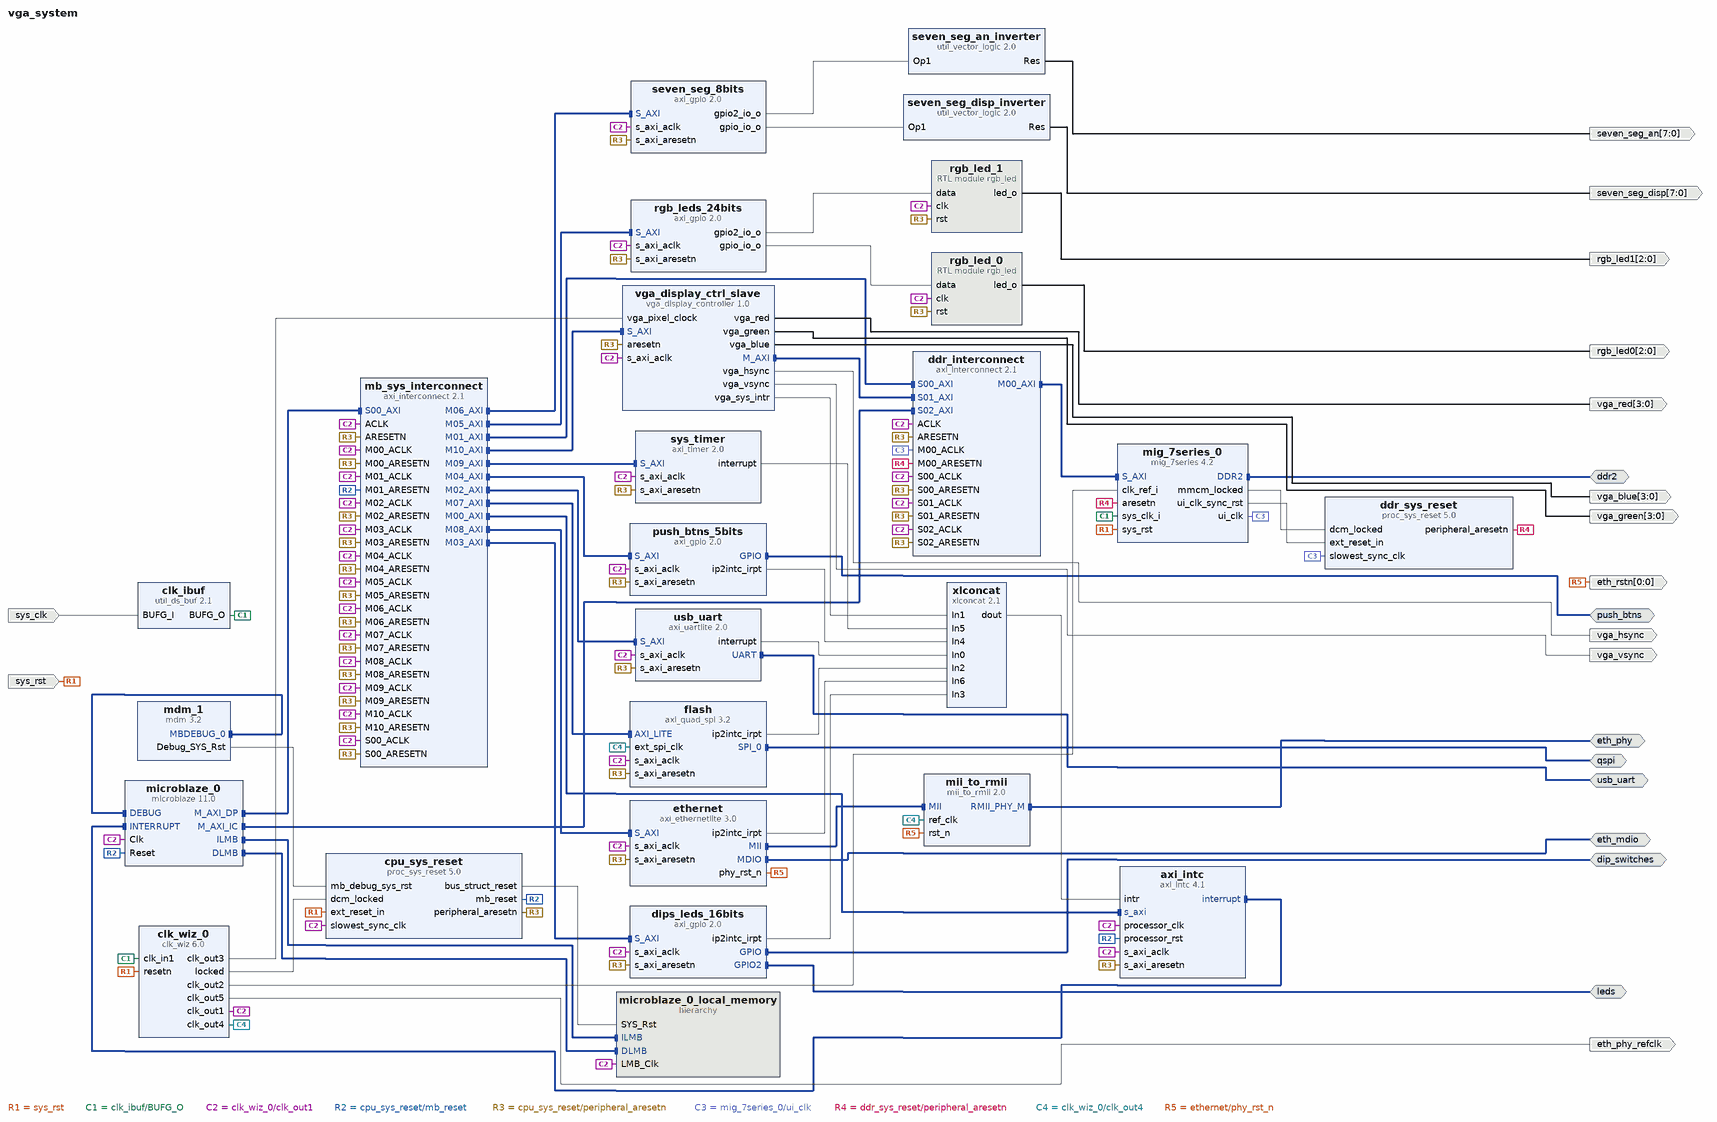
[diagram p0: block diagram of the top level]
# Vivado block design vga_system, xc7a100tcsg324-1, Vivado 2018.3.1
create_bd_design vga_system

create_bd_intf_port -mode Master -vlnv xilinx.com:interface:ddrx_rtl:1.0 ddr2
create_bd_intf_port -mode Master -vlnv xilinx.com:interface:uart_rtl:1.0 usb_uart
create_bd_intf_port -mode Master -vlnv xilinx.com:interface:gpio_rtl:1.0 leds
create_bd_intf_port -mode Master -vlnv xilinx.com:interface:gpio_rtl:1.0 push_btns
create_bd_intf_port -mode Master -vlnv xilinx.com:interface:gpio_rtl:1.0 dip_switches
create_bd_intf_port -mode Master -vlnv xilinx.com:interface:spi_rtl:1.0 qspi
create_bd_intf_port -mode Master -vlnv xilinx.com:interface:rmii_rtl:1.0 eth_phy
create_bd_intf_port -mode Master -vlnv xilinx.com:interface:mdio_rtl:1.0 eth_mdio
create_bd_port -dir I -type clk sys_clk
set_property -dict {CONFIG.ASSOCIATED_RESET sys_rst CONFIG.FREQ_HZ 100000000} [get_bd_ports sys_clk]
create_bd_port -dir I -type rst sys_rst
create_bd_port -dir O -from 7 -to 0 seven_seg_disp
create_bd_port -dir O -from 7 -to 0 seven_seg_an
create_bd_port -dir O -type clk eth_phy_refclk
set_property -dict {CONFIG.ASSOCIATED_RESET eth_rstn CONFIG.FREQ_HZ 50000000} [get_bd_ports eth_phy_refclk]
create_bd_port -dir O -from 0 -to 0 -type rst eth_rstn
create_bd_port -dir O -from 3 -to 0 vga_red
create_bd_port -dir O -from 3 -to 0 vga_green
create_bd_port -dir O -from 3 -to 0 vga_blue
create_bd_port -dir O vga_hsync
create_bd_port -dir O vga_vsync
create_bd_port -dir O -from 2 -to 0 rgb_led0
create_bd_port -dir O -from 2 -to 0 rgb_led1

create_bd_cell -type ip -vlnv xilinx.com:ip:mig_7series:4.2 mig_7series_0
set_property -dict [list \
  CONFIG.BOARD_MIG_PARAM Custom \
  CONFIG.RESET_BOARD_INTERFACE Custom \
  CONFIG.XML_INPUT_FILE mig_a.prj \
] [get_bd_cells mig_7series_0]
create_bd_cell -type ip -vlnv xilinx.com:ip:util_ds_buf:2.1 clk_ibuf
set_property -dict {CONFIG.C_BUF_TYPE BUFG} [get_bd_cells clk_ibuf]
create_bd_cell -type ip -vlnv xilinx.com:ip:clk_wiz:6.0 clk_wiz_0
set_property -dict [list \
  CONFIG.CLKOUT1_JITTER 144.481 \
  CONFIG.CLKOUT1_REQUESTED_OUT_FREQ 62.500 \
  CONFIG.CLKOUT2_JITTER 114.829 \
  CONFIG.CLKOUT2_PHASE_ERROR 98.575 \
  CONFIG.CLKOUT2_REQUESTED_OUT_FREQ 200.000 \
  CONFIG.CLKOUT2_USED true \
  CONFIG.CLKOUT3_JITTER 151.636 \
  CONFIG.CLKOUT3_PHASE_ERROR 98.575 \
  CONFIG.CLKOUT3_REQUESTED_OUT_FREQ 50.000 \
  CONFIG.CLKOUT3_USED true \
  CONFIG.CLKOUT4_JITTER 151.636 \
  CONFIG.CLKOUT4_PHASE_ERROR 98.575 \
  CONFIG.CLKOUT4_REQUESTED_OUT_FREQ 50.000 \
  CONFIG.CLKOUT4_USED true \
  CONFIG.CLKOUT5_JITTER 151.636 \
  CONFIG.CLKOUT5_PHASE_ERROR 98.575 \
  CONFIG.CLKOUT5_REQUESTED_OUT_FREQ 50.000 \
  CONFIG.CLKOUT5_REQUESTED_PHASE 45.000 \
  CONFIG.CLKOUT5_USED true \
  CONFIG.MMCM_CLKOUT0_DIVIDE_F 16.000 \
  CONFIG.MMCM_CLKOUT1_DIVIDE 5 \
  CONFIG.MMCM_CLKOUT2_DIVIDE 20 \
  CONFIG.MMCM_CLKOUT3_DIVIDE 20 \
  CONFIG.MMCM_CLKOUT4_DIVIDE 20 \
  CONFIG.MMCM_CLKOUT4_PHASE 45.000 \
  CONFIG.MMCM_DIVCLK_DIVIDE 1 \
  CONFIG.NUM_OUT_CLKS 5 \
  CONFIG.PRIM_SOURCE No_buffer \
  CONFIG.RESET_PORT resetn \
  CONFIG.RESET_TYPE ACTIVE_LOW \
] [get_bd_cells clk_wiz_0]
create_bd_cell -type ip -vlnv xilinx.com:ip:microblaze:11.0 microblaze_0
set_property -dict [list \
  CONFIG.C_ADDR_TAG_BITS 16 \
  CONFIG.C_CACHE_BYTE_SIZE 2048 \
  CONFIG.C_DCACHE_ADDR_TAG 0 \
  CONFIG.C_DEBUG_ENABLED 1 \
  CONFIG.C_D_AXI 1 \
  CONFIG.C_D_LMB 1 \
  CONFIG.C_ICACHE_LINE_LEN 8 \
  CONFIG.C_I_LMB 1 \
  CONFIG.C_USE_BARREL 1 \
  CONFIG.C_USE_DCACHE 0 \
  CONFIG.C_USE_ICACHE 1 \
  CONFIG.C_USE_REORDER_INSTR 0 \
] [get_bd_cells microblaze_0]
create_bd_cell -type hier microblaze_0_local_memory
create_bd_cell -type ip -vlnv xilinx.com:ip:axi_interconnect:2.1 mb_sys_interconnect
set_property -dict {CONFIG.NUM_MI 11} [get_bd_cells mb_sys_interconnect]
create_bd_cell -type ip -vlnv xilinx.com:ip:axi_intc:4.1 axi_intc
set_property -dict [list \
  CONFIG.C_HAS_FAST 1 \
  CONFIG.C_PROCESSOR_CLK_FREQ_MHZ 62.5 \
  CONFIG.C_S_AXI_ACLK_FREQ_MHZ 62.5 \
] [get_bd_cells axi_intc]
create_bd_cell -type ip -vlnv xilinx.com:ip:xlconcat:2.1 xlconcat
set_property -dict {CONFIG.NUM_PORTS 7} [get_bd_cells xlconcat]
create_bd_cell -type ip -vlnv xilinx.com:ip:mdm:3.2 mdm_1
create_bd_cell -type ip -vlnv xilinx.com:ip:proc_sys_reset:5.0 cpu_sys_reset
create_bd_cell -type ip -vlnv xilinx.com:ip:proc_sys_reset:5.0 ddr_sys_reset
create_bd_cell -type ip -vlnv xilinx.com:ip:axi_interconnect:2.1 ddr_interconnect
set_property -dict {CONFIG.NUM_MI 1 CONFIG.NUM_SI 3} [get_bd_cells ddr_interconnect]
create_bd_cell -type ip -vlnv xilinx.com:ip:axi_uartlite:2.0 usb_uart
set_property -dict {CONFIG.C_BAUDRATE 115200} [get_bd_cells usb_uart]
create_bd_cell -type ip -vlnv xilinx.com:ip:axi_gpio:2.0 dips_leds_16bits
set_property -dict [list \
  CONFIG.C_ALL_INPUTS 1 \
  CONFIG.C_ALL_OUTPUTS_2 1 \
  CONFIG.C_GPIO2_WIDTH 16 \
  CONFIG.C_GPIO_WIDTH 16 \
  CONFIG.C_INTERRUPT_PRESENT 1 \
  CONFIG.C_IS_DUAL 1 \
] [get_bd_cells dips_leds_16bits]
create_bd_cell -type ip -vlnv xilinx.com:ip:axi_gpio:2.0 push_btns_5bits
set_property -dict {CONFIG.C_ALL_INPUTS 1 CONFIG.C_GPIO_WIDTH 5 CONFIG.C_INTERRUPT_PRESENT 1} [get_bd_cells push_btns_5bits]
create_bd_cell -type ip -vlnv xilinx.com:ip:axi_gpio:2.0 rgb_leds_24bits
set_property -dict [list \
  CONFIG.C_ALL_OUTPUTS 1 \
  CONFIG.C_ALL_OUTPUTS_2 1 \
  CONFIG.C_GPIO2_WIDTH 24 \
  CONFIG.C_GPIO_WIDTH 24 \
  CONFIG.C_IS_DUAL 1 \
] [get_bd_cells rgb_leds_24bits]
create_bd_cell -type ip -vlnv xilinx.com:ip:axi_gpio:2.0 seven_seg_8bits
set_property -dict [list \
  CONFIG.C_ALL_OUTPUTS 1 \
  CONFIG.C_ALL_OUTPUTS_2 1 \
  CONFIG.C_GPIO2_WIDTH 8 \
  CONFIG.C_GPIO_WIDTH 8 \
  CONFIG.C_IS_DUAL 1 \
] [get_bd_cells seven_seg_8bits]
create_bd_cell -type ip -vlnv xilinx.com:ip:util_vector_logic:2.0 seven_seg_disp_inverter
set_property -dict {CONFIG.C_OPERATION not} [get_bd_cells seven_seg_disp_inverter]
create_bd_cell -type ip -vlnv xilinx.com:ip:util_vector_logic:2.0 seven_seg_an_inverter
set_property -dict {CONFIG.C_OPERATION not} [get_bd_cells seven_seg_an_inverter]
create_bd_cell -type ip -vlnv xilinx.com:ip:axi_quad_spi:3.2 flash
set_property -dict {CONFIG.C_SPI_MEMORY 3 CONFIG.C_SPI_MODE 2 CONFIG.C_TYPE_OF_AXI4_INTERFACE 0} [get_bd_cells flash]
create_bd_cell -type ip -vlnv xilinx.com:ip:mii_to_rmii:2.0 mii_to_rmii
set_property -dict {CONFIG.C_FIXED_SPEED 1} [get_bd_cells mii_to_rmii]
create_bd_cell -type ip -vlnv xilinx.com:ip:axi_ethernetlite:3.0 ethernet
create_bd_cell -type ip -vlnv xilinx.com:ip:axi_timer:2.0 sys_timer
create_bd_cell -type ip -vlnv example.com:user:vga_display_controller:1.0 vga_display_ctrl_slave
create_bd_cell -type module -reference rgb_led rgb_led_0
create_bd_cell -type module -reference rgb_led rgb_led_1

# ---- hierarchy /microblaze_0_local_memory ----
current_bd_instance /microblaze_0_local_memory
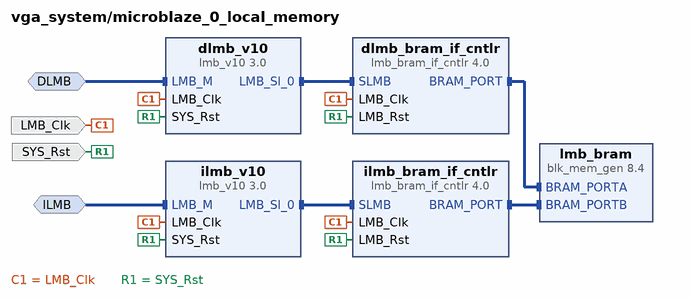
[diagram p1: block diagram inside /microblaze_0_local_memory]
create_bd_intf_pin -mode MirroredMaster -vlnv xilinx.com:interface:lmb_rtl:1.0 DLMB
create_bd_intf_pin -mode MirroredMaster -vlnv xilinx.com:interface:lmb_rtl:1.0 ILMB
create_bd_pin -dir I -type clk LMB_Clk
create_bd_pin -dir I -type rst SYS_Rst

create_bd_cell -type ip -vlnv xilinx.com:ip:lmb_v10:3.0 dlmb_v10
create_bd_cell -type ip -vlnv xilinx.com:ip:lmb_v10:3.0 ilmb_v10
create_bd_cell -type ip -vlnv xilinx.com:ip:lmb_bram_if_cntlr:4.0 dlmb_bram_if_cntlr
set_property -dict {CONFIG.C_ECC 0} [get_bd_cells dlmb_bram_if_cntlr]
create_bd_cell -type ip -vlnv xilinx.com:ip:lmb_bram_if_cntlr:4.0 ilmb_bram_if_cntlr
set_property -dict {CONFIG.C_ECC 0} [get_bd_cells ilmb_bram_if_cntlr]
create_bd_cell -type ip -vlnv xilinx.com:ip:blk_mem_gen:8.4 lmb_bram
set_property -dict {CONFIG.Memory_Type True_Dual_Port_RAM CONFIG.use_bram_block BRAM_Controller} [get_bd_cells lmb_bram]

# ---- connections ----

current_bd_instance /microblaze_0_local_memory
connect_bd_intf_net -intf_net microblaze_0_ilmb_bus [get_bd_intf_pins ilmb_v10/LMB_Sl_0] [get_bd_intf_pins ilmb_bram_if_cntlr/SLMB]
connect_bd_intf_net -intf_net microblaze_0_ilmb_cntlr [get_bd_intf_pins ilmb_bram_if_cntlr/BRAM_PORT] [get_bd_intf_pins lmb_bram/BRAM_PORTB]
connect_bd_intf_net -intf_net microblaze_0_dlmb_cntlr [get_bd_intf_pins dlmb_bram_if_cntlr/BRAM_PORT] [get_bd_intf_pins lmb_bram/BRAM_PORTA]
connect_bd_intf_net -intf_net microblaze_0_ilmb [get_bd_intf_pins ILMB] [get_bd_intf_pins ilmb_v10/LMB_M]
connect_bd_intf_net -intf_net microblaze_0_dlmb_bus [get_bd_intf_pins dlmb_v10/LMB_Sl_0] [get_bd_intf_pins dlmb_bram_if_cntlr/SLMB]
connect_bd_intf_net -intf_net microblaze_0_dlmb [get_bd_intf_pins DLMB] [get_bd_intf_pins dlmb_v10/LMB_M]
connect_bd_net -net microblaze_0_Clk [get_bd_pins LMB_Clk] \
  [get_bd_pins dlmb_v10/LMB_Clk] [get_bd_pins dlmb_bram_if_cntlr/LMB_Clk] [get_bd_pins ilmb_v10/LMB_Clk] \
  [get_bd_pins ilmb_bram_if_cntlr/LMB_Clk]
connect_bd_net [get_bd_pins SYS_Rst] \
  [get_bd_pins dlmb_v10/SYS_Rst] [get_bd_pins dlmb_bram_if_cntlr/LMB_Rst] [get_bd_pins ilmb_v10/SYS_Rst] \
  [get_bd_pins ilmb_bram_if_cntlr/LMB_Rst]
set_property HDL_ATTRIBUTE.BMM_INFO_ADDRESS_SPACE {byte  0x00000000 32 > vga_system microblaze_0_local_memory/lmb_bram} [get_bd_cells dlmb_bram_if_cntlr]
set_property HDL_ATTRIBUTE.KEEP_HIERARCHY yes [get_bd_cells dlmb_bram_if_cntlr]

current_bd_instance /
connect_bd_intf_net [get_bd_intf_ports ddr2] [get_bd_intf_pins mig_7series_0/DDR2]
connect_bd_intf_net -intf_net axi_ethernetlite_0_MII [get_bd_intf_pins ethernet/MII] [get_bd_intf_pins mii_to_rmii/MII]
connect_bd_intf_net [get_bd_intf_pins microblaze_0/ILMB] [get_bd_intf_pins microblaze_0_local_memory/ILMB]
connect_bd_intf_net [get_bd_intf_ports eth_phy] [get_bd_intf_pins mii_to_rmii/RMII_PHY_M]
connect_bd_intf_net -intf_net microblaze_0_intc_axi [get_bd_intf_pins mb_sys_interconnect/M00_AXI] [get_bd_intf_pins axi_intc/s_axi]
connect_bd_intf_net -intf_net axi_interconnect_0_M00_AXI [get_bd_intf_pins ddr_interconnect/M00_AXI] [get_bd_intf_pins mig_7series_0/S_AXI]
connect_bd_intf_net [get_bd_intf_pins microblaze_0/DLMB] [get_bd_intf_pins microblaze_0_local_memory/DLMB]
connect_bd_intf_net [get_bd_intf_pins mdm_1/MBDEBUG_0] [get_bd_intf_pins microblaze_0/DEBUG]
connect_bd_intf_net [get_bd_intf_pins axi_intc/interrupt] [get_bd_intf_pins microblaze_0/INTERRUPT]
connect_bd_intf_net -intf_net microblaze_0_axi_dp [get_bd_intf_pins mb_sys_interconnect/S00_AXI] [get_bd_intf_pins microblaze_0/M_AXI_DP]
connect_bd_intf_net -intf_net axi_ethernetlite_0_MDIO [get_bd_intf_ports eth_mdio] [get_bd_intf_pins ethernet/MDIO]
connect_bd_intf_net [get_bd_intf_pins mb_sys_interconnect/M02_AXI] [get_bd_intf_pins usb_uart/S_AXI]
connect_bd_intf_net [get_bd_intf_pins mb_sys_interconnect/M06_AXI] [get_bd_intf_pins seven_seg_8bits/S_AXI]
connect_bd_intf_net -intf_net vga_display_controll_0_M_AXI [get_bd_intf_pins vga_display_ctrl_slave/M_AXI] [get_bd_intf_pins ddr_interconnect/S01_AXI]
connect_bd_intf_net [get_bd_intf_pins mb_sys_interconnect/M09_AXI] [get_bd_intf_pins sys_timer/S_AXI]
connect_bd_intf_net [get_bd_intf_pins microblaze_0/M_AXI_IC] [get_bd_intf_pins ddr_interconnect/S02_AXI]
connect_bd_intf_net [get_bd_intf_pins mb_sys_interconnect/M10_AXI] [get_bd_intf_pins vga_display_ctrl_slave/S_AXI]
connect_bd_intf_net [get_bd_intf_pins mb_sys_interconnect/M07_AXI] [get_bd_intf_pins flash/AXI_LITE]
connect_bd_intf_net [get_bd_intf_ports push_btns] [get_bd_intf_pins push_btns_5bits/GPIO]
connect_bd_intf_net [get_bd_intf_pins mb_sys_interconnect/M05_AXI] [get_bd_intf_pins rgb_leds_24bits/S_AXI]
connect_bd_intf_net [get_bd_intf_pins mb_sys_interconnect/M04_AXI] [get_bd_intf_pins push_btns_5bits/S_AXI]
connect_bd_intf_net [get_bd_intf_ports qspi] [get_bd_intf_pins flash/SPI_0]
connect_bd_intf_net [get_bd_intf_pins mb_sys_interconnect/M08_AXI] [get_bd_intf_pins ethernet/S_AXI]
connect_bd_intf_net [get_bd_intf_ports usb_uart] [get_bd_intf_pins usb_uart/UART]
connect_bd_intf_net [get_bd_intf_ports dip_switches] [get_bd_intf_pins dips_leds_16bits/GPIO]
connect_bd_intf_net [get_bd_intf_ports leds] [get_bd_intf_pins dips_leds_16bits/GPIO2]
connect_bd_intf_net [get_bd_intf_pins mb_sys_interconnect/M01_AXI] [get_bd_intf_pins ddr_interconnect/S00_AXI]
connect_bd_intf_net [get_bd_intf_pins mb_sys_interconnect/M03_AXI] [get_bd_intf_pins dips_leds_16bits/S_AXI]
connect_bd_net [get_bd_ports sys_rst] [get_bd_pins mig_7series_0/sys_rst] [get_bd_pins clk_wiz_0/resetn] [get_bd_pins cpu_sys_reset/ext_reset_in]
connect_bd_net [get_bd_ports sys_clk] [get_bd_pins clk_ibuf/BUFG_I]
connect_bd_net -net util_ds_buf_0_BUFG_O [get_bd_pins clk_ibuf/BUFG_O] [get_bd_pins mig_7series_0/sys_clk_i] [get_bd_pins clk_wiz_0/clk_in1]
connect_bd_net [get_bd_pins clk_wiz_0/clk_out2] [get_bd_pins mig_7series_0/clk_ref_i]
connect_bd_net -net microblaze_0_intr [get_bd_pins xlconcat/dout] [get_bd_pins axi_intc/intr]
connect_bd_net -net microblaze_0_Clk [get_bd_pins clk_wiz_0/clk_out1] \
  [get_bd_pins microblaze_0/Clk] [get_bd_pins mb_sys_interconnect/ACLK] [get_bd_pins mb_sys_interconnect/S00_ACLK] \
  [get_bd_pins mb_sys_interconnect/M00_ACLK] [get_bd_pins axi_intc/s_axi_aclk] [get_bd_pins axi_intc/processor_clk] \
  [get_bd_pins microblaze_0_local_memory/LMB_Clk] [get_bd_pins cpu_sys_reset/slowest_sync_clk] \
  [get_bd_pins mb_sys_interconnect/M01_ACLK] [get_bd_pins ddr_interconnect/ACLK] [get_bd_pins ddr_interconnect/S00_ACLK] \
  [get_bd_pins ddr_interconnect/S01_ACLK] [get_bd_pins ddr_interconnect/S02_ACLK] [get_bd_pins usb_uart/s_axi_aclk] \
  [get_bd_pins mb_sys_interconnect/M02_ACLK] [get_bd_pins mb_sys_interconnect/M03_ACLK] \
  [get_bd_pins dips_leds_16bits/s_axi_aclk] [get_bd_pins push_btns_5bits/s_axi_aclk] \
  [get_bd_pins mb_sys_interconnect/M04_ACLK] [get_bd_pins rgb_leds_24bits/s_axi_aclk] \
  [get_bd_pins mb_sys_interconnect/M05_ACLK] [get_bd_pins seven_seg_8bits/s_axi_aclk] \
  [get_bd_pins mb_sys_interconnect/M06_ACLK] [get_bd_pins flash/s_axi_aclk] [get_bd_pins mb_sys_interconnect/M07_ACLK] \
  [get_bd_pins ethernet/s_axi_aclk] [get_bd_pins mb_sys_interconnect/M08_ACLK] [get_bd_pins sys_timer/s_axi_aclk] \
  [get_bd_pins mb_sys_interconnect/M09_ACLK] [get_bd_pins vga_display_ctrl_slave/s_axi_aclk] \
  [get_bd_pins mb_sys_interconnect/M10_ACLK] [get_bd_pins rgb_led_0/clk] [get_bd_pins rgb_led_1/clk]
connect_bd_net [get_bd_pins clk_wiz_0/locked] [get_bd_pins cpu_sys_reset/dcm_locked]
connect_bd_net -net rst_clk_wiz_0_62M_mb_reset [get_bd_pins cpu_sys_reset/mb_reset] \
  [get_bd_pins microblaze_0/Reset] [get_bd_pins axi_intc/processor_rst] [get_bd_pins mb_sys_interconnect/M01_ARESETN]
connect_bd_net -net rst_clk_wiz_0_62M_bus_struct_reset [get_bd_pins cpu_sys_reset/bus_struct_reset] [get_bd_pins microblaze_0_local_memory/SYS_Rst]
connect_bd_net -net rst_clk_wiz_0_62M_peripheral_aresetn [get_bd_pins cpu_sys_reset/peripheral_aresetn] \
  [get_bd_pins mb_sys_interconnect/ARESETN] [get_bd_pins mb_sys_interconnect/S00_ARESETN] \
  [get_bd_pins mb_sys_interconnect/M00_ARESETN] [get_bd_pins axi_intc/s_axi_aresetn] [get_bd_pins ddr_interconnect/ARESETN] \
  [get_bd_pins ddr_interconnect/S00_ARESETN] [get_bd_pins ddr_interconnect/S01_ARESETN] \
  [get_bd_pins ddr_interconnect/S02_ARESETN] [get_bd_pins usb_uart/s_axi_aresetn] \
  [get_bd_pins mb_sys_interconnect/M02_ARESETN] [get_bd_pins mb_sys_interconnect/M03_ARESETN] \
  [get_bd_pins dips_leds_16bits/s_axi_aresetn] [get_bd_pins push_btns_5bits/s_axi_aresetn] \
  [get_bd_pins mb_sys_interconnect/M04_ARESETN] [get_bd_pins rgb_leds_24bits/s_axi_aresetn] \
  [get_bd_pins mb_sys_interconnect/M05_ARESETN] [get_bd_pins seven_seg_8bits/s_axi_aresetn] \
  [get_bd_pins mb_sys_interconnect/M06_ARESETN] [get_bd_pins flash/s_axi_aresetn] \
  [get_bd_pins mb_sys_interconnect/M07_ARESETN] [get_bd_pins ethernet/s_axi_aresetn] \
  [get_bd_pins mb_sys_interconnect/M08_ARESETN] [get_bd_pins sys_timer/s_axi_aresetn] \
  [get_bd_pins mb_sys_interconnect/M09_ARESETN] [get_bd_pins vga_display_ctrl_slave/aresetn] \
  [get_bd_pins mb_sys_interconnect/M10_ARESETN] [get_bd_pins rgb_led_0/rst] [get_bd_pins rgb_led_1/rst]
connect_bd_net [get_bd_pins mdm_1/Debug_SYS_Rst] [get_bd_pins cpu_sys_reset/mb_debug_sys_rst]
connect_bd_net [get_bd_pins mig_7series_0/ui_clk] [get_bd_pins ddr_sys_reset/slowest_sync_clk] [get_bd_pins ddr_interconnect/M00_ACLK]
connect_bd_net [get_bd_pins mig_7series_0/mmcm_locked] [get_bd_pins ddr_sys_reset/dcm_locked]
connect_bd_net [get_bd_pins mig_7series_0/ui_clk_sync_rst] [get_bd_pins ddr_sys_reset/ext_reset_in]
connect_bd_net -net rst_mig_7series_0_81M_peripheral_aresetn [get_bd_pins ddr_sys_reset/peripheral_aresetn] \
  [get_bd_pins mig_7series_0/aresetn] [get_bd_pins ddr_interconnect/M00_ARESETN]
connect_bd_net [get_bd_pins seven_seg_8bits/gpio_io_o] [get_bd_pins seven_seg_disp_inverter/Op1]
connect_bd_net [get_bd_pins seven_seg_8bits/gpio2_io_o] [get_bd_pins seven_seg_an_inverter/Op1]
connect_bd_net [get_bd_pins seven_seg_disp_inverter/Res] [get_bd_ports seven_seg_disp]
connect_bd_net [get_bd_pins seven_seg_an_inverter/Res] [get_bd_ports seven_seg_an]
connect_bd_net [get_bd_pins clk_wiz_0/clk_out4] [get_bd_pins flash/ext_spi_clk] [get_bd_pins mii_to_rmii/ref_clk]
connect_bd_net [get_bd_pins clk_wiz_0/clk_out5] [get_bd_ports eth_phy_refclk]
connect_bd_net [get_bd_pins usb_uart/interrupt] [get_bd_pins xlconcat/In0]
connect_bd_net [get_bd_pins flash/ip2intc_irpt] [get_bd_pins xlconcat/In2]
connect_bd_net [get_bd_pins dips_leds_16bits/ip2intc_irpt] [get_bd_pins xlconcat/In3]
connect_bd_net [get_bd_pins push_btns_5bits/ip2intc_irpt] [get_bd_pins xlconcat/In4]
connect_bd_net [get_bd_pins sys_timer/interrupt] [get_bd_pins xlconcat/In5]
connect_bd_net [get_bd_pins ethernet/ip2intc_irpt] [get_bd_pins xlconcat/In6]
connect_bd_net [get_bd_pins clk_wiz_0/clk_out3] [get_bd_pins vga_display_ctrl_slave/vga_pixel_clock]
connect_bd_net -net vga_display_controll_0_vga_red [get_bd_pins vga_display_ctrl_slave/vga_red] [get_bd_ports vga_red]
connect_bd_net -net vga_display_controll_0_vga_green [get_bd_pins vga_display_ctrl_slave/vga_green] [get_bd_ports vga_green]
connect_bd_net -net vga_display_controll_0_vga_blue [get_bd_pins vga_display_ctrl_slave/vga_blue] [get_bd_ports vga_blue]
connect_bd_net -net vga_display_controll_0_vga_hsync [get_bd_pins vga_display_ctrl_slave/vga_hsync] [get_bd_ports vga_hsync]
connect_bd_net -net vga_display_controll_0_vga_vsync [get_bd_pins vga_display_ctrl_slave/vga_vsync] [get_bd_ports vga_vsync]
connect_bd_net [get_bd_pins vga_display_ctrl_slave/vga_sys_intr] [get_bd_pins xlconcat/In1]
connect_bd_net [get_bd_pins rgb_led_0/led_o] [get_bd_ports rgb_led0]
connect_bd_net [get_bd_pins rgb_leds_24bits/gpio_io_o] [get_bd_pins rgb_led_0/data]
connect_bd_net [get_bd_pins rgb_leds_24bits/gpio2_io_o] [get_bd_pins rgb_led_1/data]
connect_bd_net [get_bd_pins rgb_led_1/led_o] [get_bd_ports rgb_led1]
connect_bd_net [get_bd_pins ethernet/phy_rst_n] [get_bd_pins mii_to_rmii/rst_n] [get_bd_ports eth_rstn]
set_property HDL_ATTRIBUTE.BMM_INFO_PROCESSOR {microblaze-le > vga_system microblaze_0_local_memory/dlmb_bram_if_cntlr} [get_bd_cells microblaze_0]
set_property HDL_ATTRIBUTE.KEEP_HIERARCHY yes [get_bd_cells microblaze_0]

# ---- address map ----
assign_bd_address -offset 0x00000000 -range 16K -target_address_space [get_bd_addr_spaces microblaze_0/Data] [get_bd_addr_segs microblaze_0_local_memory/dlmb_bram_if_cntlr/SLMB/Mem]
assign_bd_address -offset 0x40000000 -range 64K -target_address_space [get_bd_addr_spaces microblaze_0/Data] [get_bd_addr_segs dips_leds_16bits/S_AXI/Reg]
assign_bd_address -offset 0x40010000 -range 64K -target_address_space [get_bd_addr_spaces microblaze_0/Data] [get_bd_addr_segs push_btns_5bits/S_AXI/Reg]
assign_bd_address -offset 0x40020000 -range 64K -target_address_space [get_bd_addr_spaces microblaze_0/Data] [get_bd_addr_segs rgb_leds_24bits/S_AXI/Reg]
assign_bd_address -offset 0x40030000 -range 64K -target_address_space [get_bd_addr_spaces microblaze_0/Data] [get_bd_addr_segs seven_seg_8bits/S_AXI/Reg]
assign_bd_address -offset 0x40600000 -range 64K -target_address_space [get_bd_addr_spaces microblaze_0/Data] [get_bd_addr_segs usb_uart/S_AXI/Reg]
assign_bd_address -offset 0x40E00000 -range 64K -target_address_space [get_bd_addr_spaces microblaze_0/Data] [get_bd_addr_segs ethernet/S_AXI/Reg]
assign_bd_address -offset 0x41200000 -range 64K -target_address_space [get_bd_addr_spaces microblaze_0/Data] [get_bd_addr_segs axi_intc/S_AXI/Reg]
assign_bd_address -offset 0x41C00000 -range 64K -target_address_space [get_bd_addr_spaces microblaze_0/Data] [get_bd_addr_segs sys_timer/S_AXI/Reg]
assign_bd_address -offset 0x44A00000 -range 64K -target_address_space [get_bd_addr_spaces microblaze_0/Data] [get_bd_addr_segs flash/AXI_LITE/Reg]
assign_bd_address -offset 0x44A10000 -range 64K -target_address_space [get_bd_addr_spaces microblaze_0/Data] [get_bd_addr_segs vga_display_ctrl_slave/S_AXI/Reg]
assign_bd_address -offset 0x80000000 -range 128M -target_address_space [get_bd_addr_spaces microblaze_0/Data] [get_bd_addr_segs mig_7series_0/memmap/memaddr]
assign_bd_address -offset 0x00000000 -range 16K -target_address_space [get_bd_addr_spaces microblaze_0/Instruction] [get_bd_addr_segs microblaze_0_local_memory/ilmb_bram_if_cntlr/SLMB/Mem]
assign_bd_address -offset 0x80000000 -range 128M -target_address_space [get_bd_addr_spaces microblaze_0/Instruction] [get_bd_addr_segs mig_7series_0/memmap/memaddr]
assign_bd_address -offset 0x80000000 -range 128M -target_address_space [get_bd_addr_spaces vga_display_ctrl_slave/M_AXI] [get_bd_addr_segs mig_7series_0/memmap/memaddr]

validate_bd_design
save_bd_design
